# Altium project Voltage and Current Data Loggers and Recorders.PrjPCB
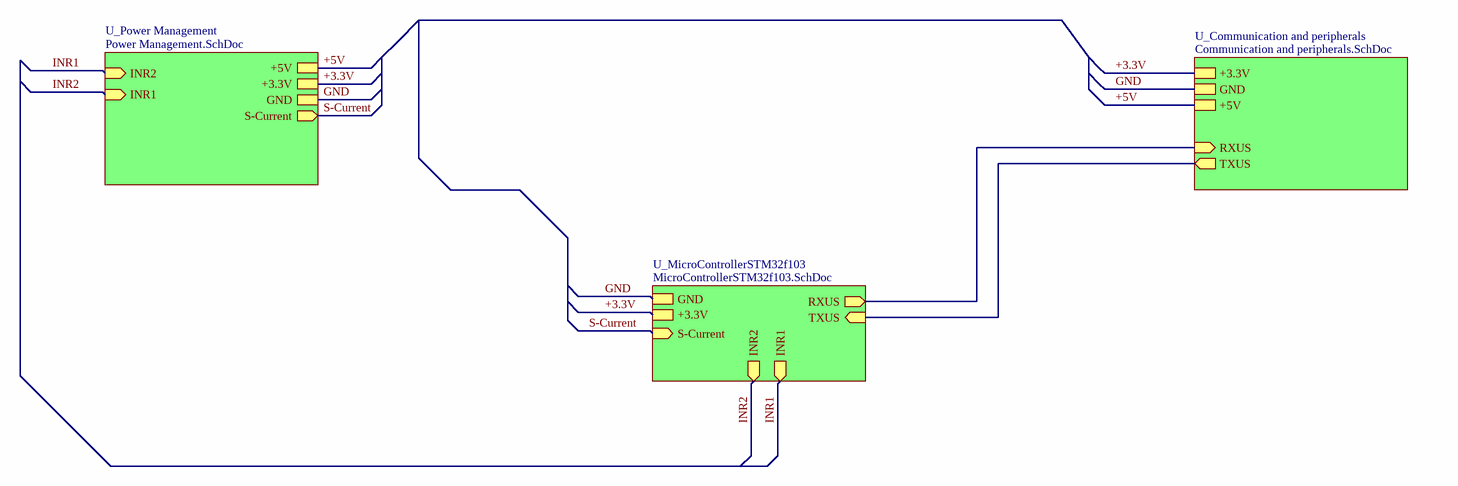
[diagram p0: A dashBoard of Voltage and Current Data Loggers and Recorders.SchDoc]
4 sheets, 71 parts. Net scope: hierarchical (ports join the sheet entries above them; power ports are global).
Board file: Voltage and Current Data Loggers and Recorders.PcbDoc
Sheets:
  A dashBoard of Voltage and Current Data Loggers and Recorders.SchDoc
    U_Communication and peripherals = Communication and peripherals.SchDoc
    U_Power Management = Power Management.SchDoc
    U_MicroControllerSTM32f103 = MicroControllerSTM32f103.SchDoc

## Sheet A dashBoard of Voltage and Current Data Loggers and Recorders.SchDoc
size A4

### Sub-sheets
U_Communication and peripherals = Communication and peripherals.SchDoc: TXUS (out), RXUS (in), GND, +5V, +3.3V
U_MicroControllerSTM32f103 = MicroControllerSTM32f103.SchDoc: GND, +3.3V, RXUS (out), TXUS (in), INR1 (out), INR2 (out), S-Current (in)
U_Power Management = Power Management.SchDoc: +5V, +3.3V, GND, S-Current (out), INR2 (in), INR1 (in)

### Nets
+3.3V: sheet U_Communication and peripherals/+3.3V, sheet U_Power Management/+3.3V, sheet U_MicroControllerSTM32f103/+3.3V
+5V: sheet U_Communication and peripherals/+5V, sheet U_Power Management/+5V
GND: sheet U_Communication and peripherals/GND, sheet U_Power Management/GND, sheet U_MicroControllerSTM32f103/GND
INR1: sheet U_Power Management/INR2, sheet U_MicroControllerSTM32f103/INR1
INR2: sheet U_Power Management/INR1, sheet U_MicroControllerSTM32f103/INR2
RXUS: sheet U_Communication and peripherals/RXUS, sheet U_MicroControllerSTM32f103/RXUS
S-Current: sheet U_Power Management/S-Current, sheet U_MicroControllerSTM32f103/S-Current
TXUS: sheet U_Communication and peripherals/TXUS, sheet U_MicroControllerSTM32f103/TXUS

### Notes on the sheet
- Title
- Size:
- Data:
- CompanyName:
- A4
- Number:
- Time:
- Revision:
- Engineer:
- File:

## Sheet Communication and peripherals.SchDoc
size A4
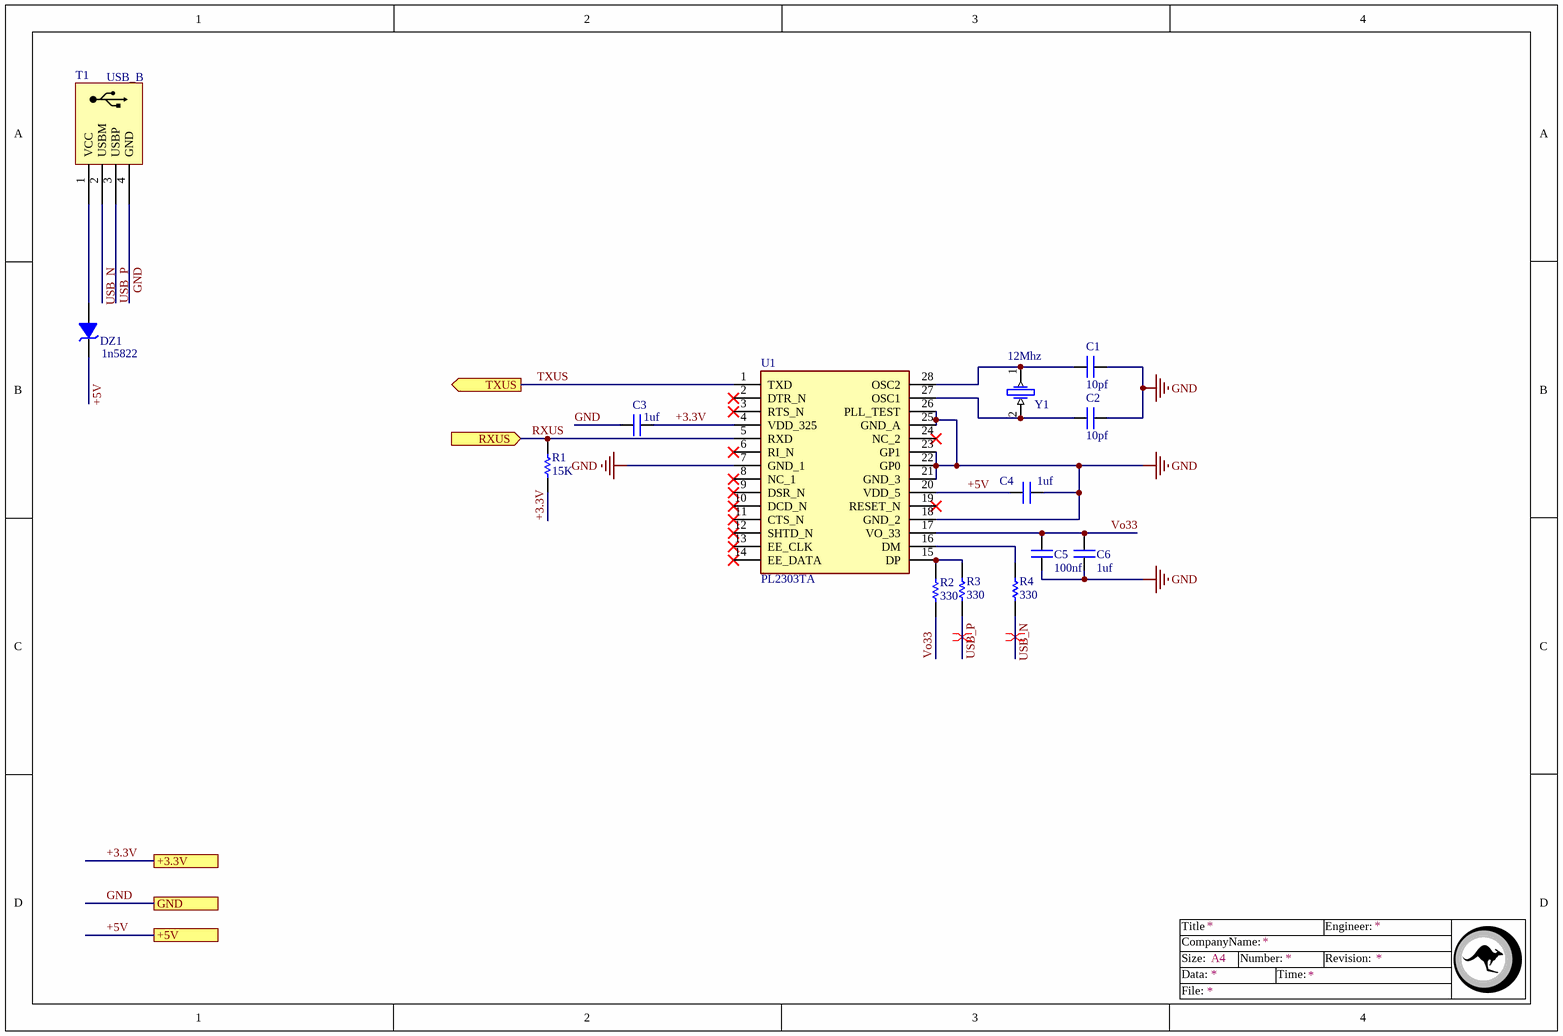
[diagram p1: Communication and peripherals.SchDoc]

### Parts
C1  10pf  [Cap0805]
C2  10pf  [Cap0805]
C3  1uf  [Cap0805]
C4  1uf  [Cap0805]
C5  100nf  [Cap0805]
C6  1uf  [Cap0805]
DZ1  1n5822  [LL4148]
R1  15K  [R0805]
R2  330  [R0805]
R3  330  [R0805]
R4  330  [R0805]
T1  USB_B  [USB_Dip_R]
U1  PL2303TA  [SOP65P780X200-28N]
Y1  12Mhz  [CrystallB]

### Ports
+3.3V, +5V, GND, RXUS (in), TXUS (out)

### Nets
+3.3V: C3.2 R1.1 U1.4(VDD_325) ; port +3.3V
+5V: C4.2 DZ1.K U1.20(VDD_5) ; port +5V
GND: C1.2 C2.2 C3.1 C4.1 C5.1 C6.1 T1.4(GND) U1.7(GND_1) U1.18(GND_2) U1.21(GND_3) U1.22(GP0) U1.23(GP1) U1.25(GND_A) U1.26(PLL_TEST) ; port GND
RXUS: R1.2 U1.5(RXD) ; port RXUS
TXUS: U1.1(TXD) ; port TXUS
USB_N: R4.1 T1.2(USBM)
USB_P: R3.1 T1.3(USBP)
Vo33: C5.2 C6.2 R2.1 U1.17(VO_33)
NetC1_1: C1.1 U1.28(OSC2) Y1.1
NetC2_1: C2.1 U1.27(OSC1) Y1.2
NetDZ1_A: DZ1.A T1.1(VCC)
NetR2_2: R2.2 R3.2 U1.15(DP)
NetR4_2: R4.2 U1.16(DM)

Not connected (* = marked no-connect by the designer): U1 2(DTR_N)* 3(RTS_N)* 6(RI_N)* 8(NC_1)* 9(DSR_N)* 10(DCD_N)* 11(CTS_N)* 12(SHTD_N)* 13(EE_CLK)* 14(EE_DATA)* 19(RESET_N)* 24(NC_2)*

### Layout directives
differential pair: USB_N, USB_P

### Notes on the sheet
- Title
- Size:
- Data:
- CompanyName:
- A4
- Number:
- Time:
- Revision:
- Engineer:
- File:

### Library data of the parts
C1-C6 = Cap: Surface mount Capacitor
DZ1 = Diode Zener
R1-R4 = Resistor
T1 = USB_B: USB B Connector
U1 = PL2303TA: Uart Chip
Y1 = Crystal

## Sheet Power Management.SchDoc
size A4
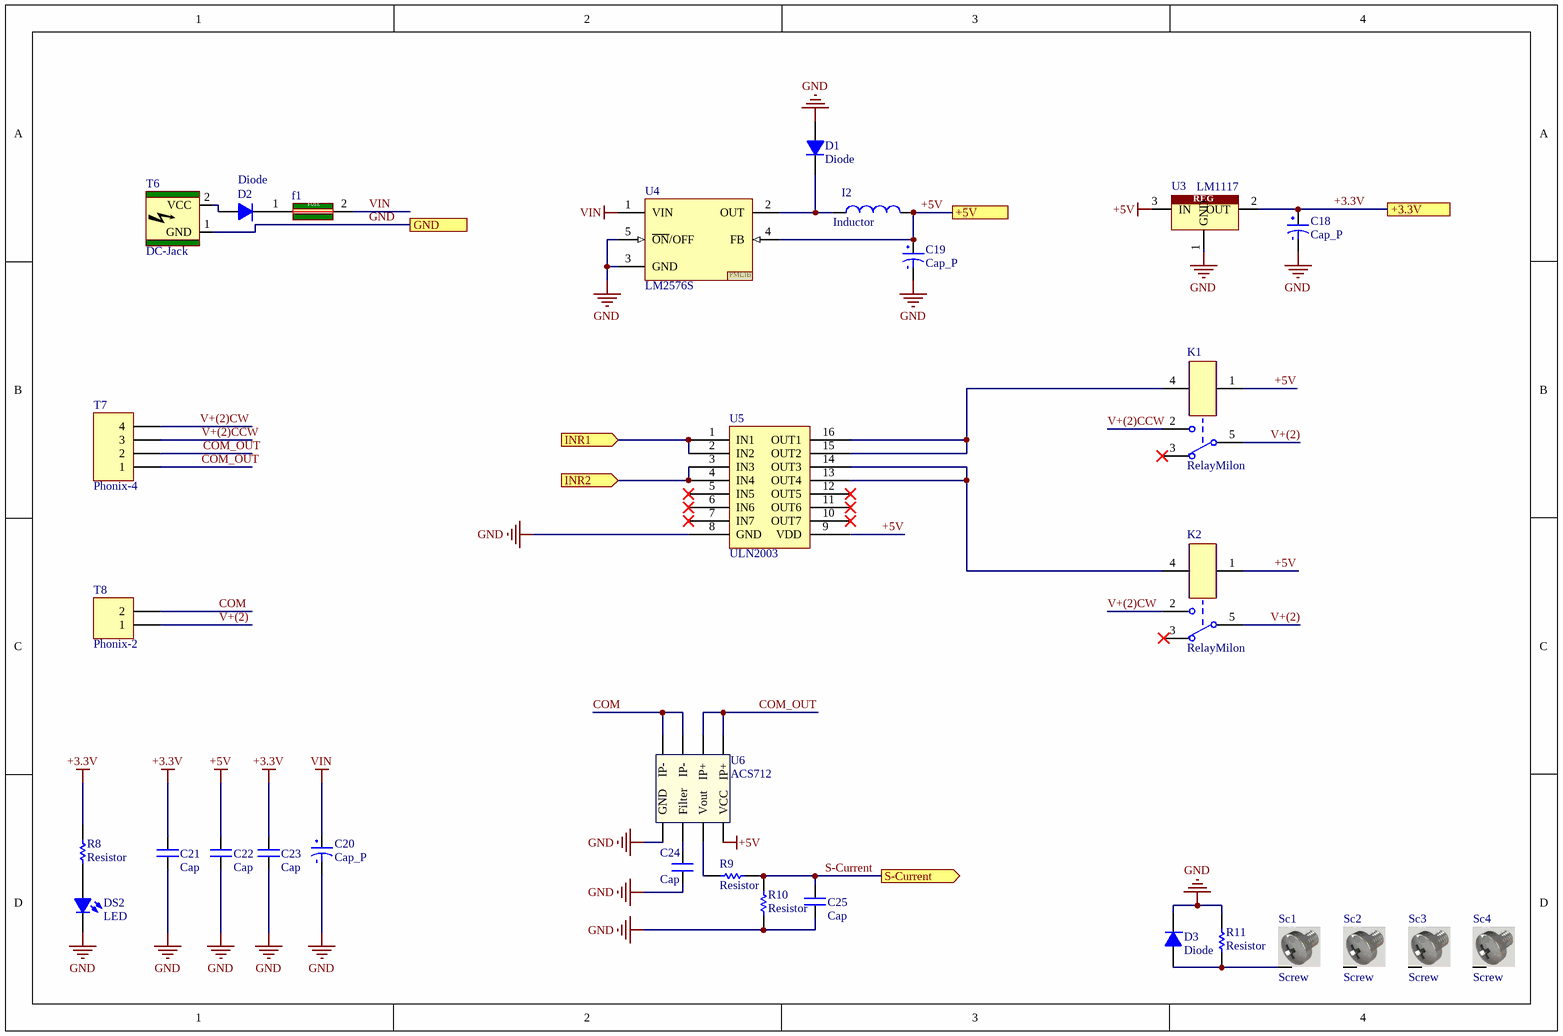
[diagram p2: Power Management.SchDoc]

### Parts
C18  Cap_P  [Cap_4mm]
C19  Cap_P  [Cap_4mm]
C20  Cap_P  [Cap_5mm]
C21  Cap  [Cap0805]
C22  Cap  [Cap0805]
C23  Cap  [Cap0805]
C24  Cap  [Cap0805]
C25  Cap  [Cap0805]
D1  Diode  [Diod-1A-SMD]
D2  Diode  [Diod-1A-SMD]
D3  Diode  [Diod-1A-SMD]
DS2  LED  [Led0805]
f1  Fuse  [1206]  (value not drawn)
I2  Inductor  [Indicator_SMD]
K1  RelayMilon  [Relay_MILONBIG]
K2  RelayMilon  [Relay_MILONBIG]
R8  Resistor  [R0805]
R9  Resistor  [R0805]
R10  Resistor  [R0805]
R11  Resistor  [0603]
Sc1  Screw  [Screw]
Sc2  Screw  [Screw]
Sc3  Screw  [Screw]
Sc4  Screw  [Screw]
T6  DC-Jack  [DC_powerjack]
T7  Phonix-4  [Phonix-4]
T8  Phonix-2  [Phonix-2]
U3  LM1117  [DPACK]
U4  LM2576S  [LM2576S]
U5  ULN2003  [SO16]
U6  ACS712  [SOP8]

### Ports
+3.3V, +5V, GND, INR1 (in), INR2 (in), S-Current (out)

### Nets
+3.3V: C18.2 C21.2 C23.2 R8.1 U3.2(OUT) ; port +3.3V
+5V: C19.2 C22.2 I2.2 K1.1 K2.1 U3.3(IN) U4.4(FB) U5.9(VDD) U6.8(VCC) ; port +5V
GND: C18.1 C19.1 C20.1 C21.1 C22.1 C23.1 C24.1 C25.1 D1.A D3.K DS2.K R10.2 R11.1 T6.1(GND) U3.1(GND) U4.3(GND) U4.5(~{ON}/OFF) U5.8(GND) U6.5(GND) ; port GND
VIN: C20.2 f1.2(OUT) U4.1(VIN)
COM: T8.2 U6.3(IP-) U6.4(IP-)
COM_OUT: T7.1 T7.2 U6.1(IP+) U6.2(IP+)
INR1: U5.3(IN3) U5.4(IN4) ; port INR2
INR2: U5.1(IN1) U5.2(IN2) ; port INR1
S-Current: C25.2 R9.1 R10.1 ; port S-Current
V+(2): K1.5 K2.5 T8.1
V+(2)CCW: K1.2 T7.3
V+(2)CW: K2.2 T7.4
NetC24_2: C24.2 U6.6(Filter)
NetD1_K: D1.K I2.1 U4.2(OUT)
NetD2_A: D2.A T6.2(VCC)
NetD2_K: D2.K f1.1(IN)
NetD3_A: D3.A R11.2 Sc1.S
NetDS2_A: DS2.A R8.2
NetK1_4: K1.4 U5.15(OUT2) U5.16(OUT1)
NetK2_4: K2.4 U5.13(OUT4) U5.14(OUT3)
NetR9_2: R9.2 U6.7(Vout)

Not connected (* = marked no-connect by the designer): K1 3*; K2 3; Sc2 S; Sc3 S; Sc4 S; U5 5(IN5)* 6(IN6)* 7(IN7)* 10(OUT7)* 11(OUT6)* 12(OUT5)*

### Notes on the sheet
- Title
- Size:
- Data:
- CompanyName:
- A4
- Number:
- Time:
- Revision:
- Engineer:
- File:
- (in symbol Fuse) FUSE
- (in symbol LM1117) REG
- (in symbol LM2576S) PMLIB

### Library data of the parts
C18-C20 = Cap_P: Polarity
C21-C25 = Cap: Surface mount Capacitor
I2 = Inductor: Indicator
Sc1-Sc4 = Screw: Screw 3mm
T7 = Phonix-4: Connector
T8 = Phonix-2: Connector
U3 = LM1117: Regulator
U4 = LM2576S: Regulator
U5 = ULN2003: High-voltage, high-current Darlington arrays
U6 = ACS712: Hall effect Current Sensor

## Sheet MicroControllerSTM32f103.SchDoc
size A4
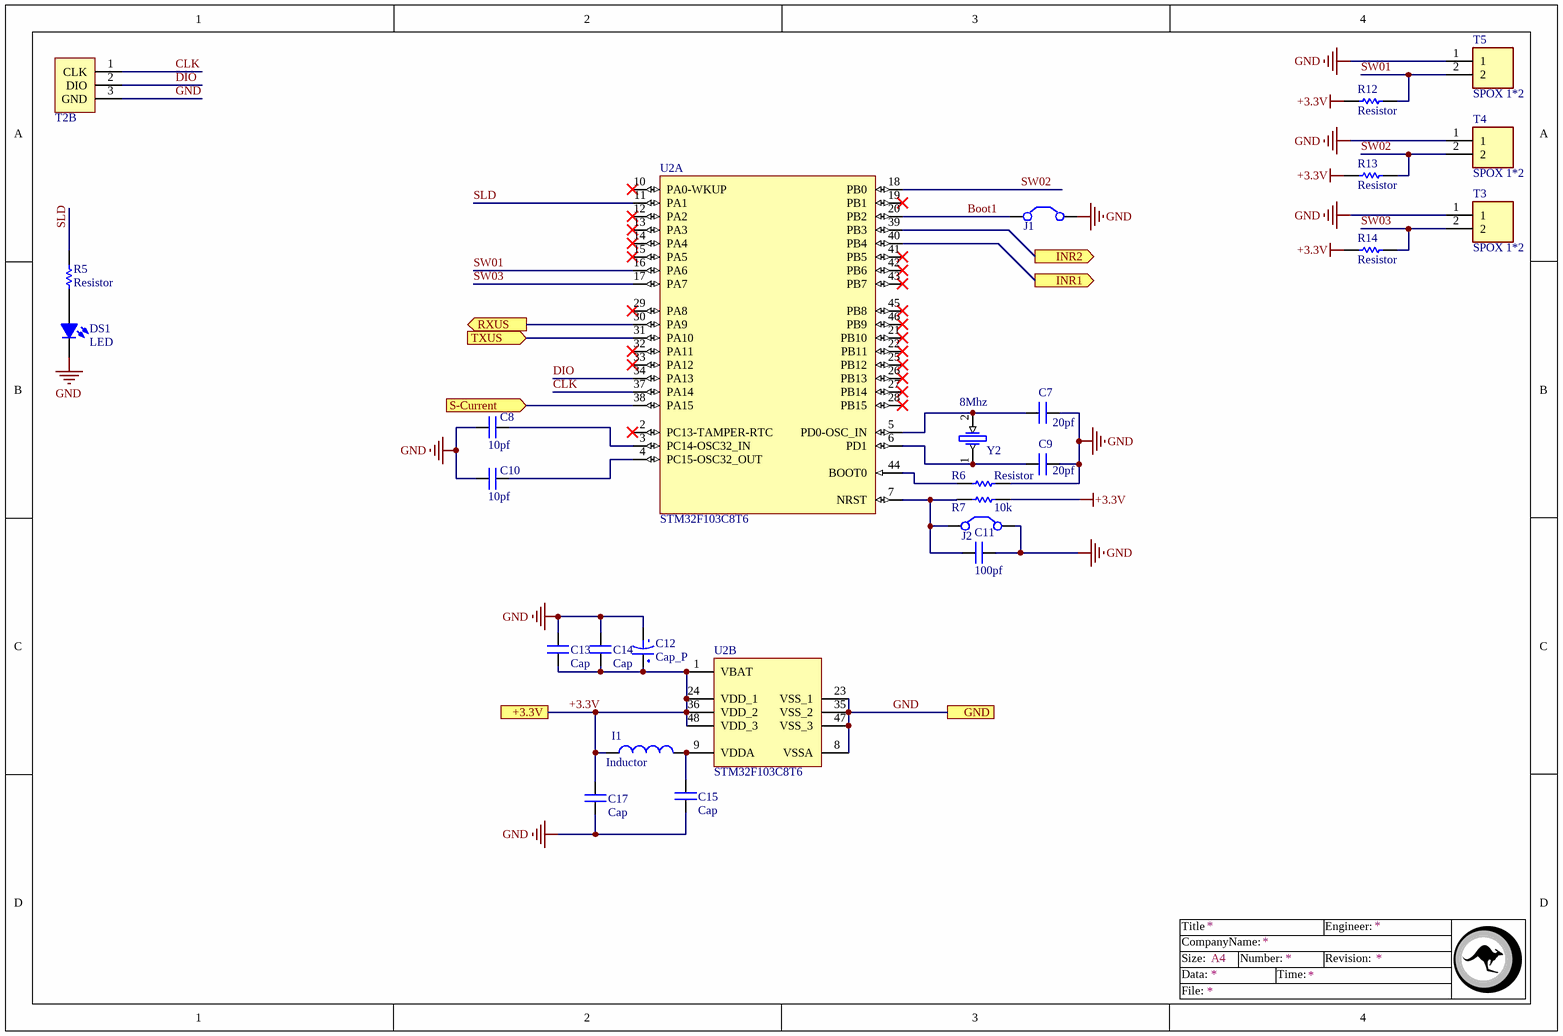
[diagram p3: MicroControllerSTM32f103.SchDoc]

### Parts
C7  20pf  [Cap0805]
C8  10pf  [Cap0805]
C9  20pf  [Cap0805]
C10  10pf  [Cap0805]
C11  100pf  [Cap0805]
C12  Cap_P  [CAPMOL_C]
C13  Cap  [Cap0805]
C14  Cap  [Cap0805]
C15  Cap  [Cap0805]
C17  Cap  [Cap0805]
DS1  LED  [Led0805]
I1  Inductor  [1206]
J1  Jumper  [Jumper SMD - Small]  (value not drawn)
J2  Jumper  [Jumper SMD - Small]  (value not drawn)
R5  Resistor  [R0805]
R6  Resistor  [R0805]
R7  10k  [R0805]
R12  Resistor  [0603]
R13  Resistor  [0603]
R14  Resistor  [0603]
T2  Serial Program  [MHDR1X03-254P - E]  (value not drawn)  (part B of 2)
T3  SPOX 1*2  [SPOX2]
T4  SPOX 1*2  [SPOX2]
T5  SPOX 1*2  [SPOX2]
U2  STM32F103C8T6  [LQFP48_L]  (parts A,B of 2)
Y2  8Mhz  [CrystallB]

### Ports
+3.3V, GND, INR1 (out), INR2 (out), RXUS (out), S-Current (in), TXUS (in)

### Nets
+3.3V: C12.2 C13.1 C14.1 C17.2 I1.1 R7.1 R12.1 R13.1 R14.1 U2.1(VBAT) U2.24(VDD_1) U2.36(VDD_2) U2.48(VDD_3) ; port +3.3V
GND: C7.1 C8.1 C9.1 C10.1 C11.2 C12.1 C13.2 C14.2 C15.1 C17.1 DS1.K J1.2(C2) J2.2(C2) R6.2 T2.3(GND) T3.1 T4.1 T5.1 U2.8(VSSA) U2.23(VSS_1) U2.35(VSS_2) U2.47(VSS_3) ; port GND
Boot1: J1.1(C1) U2.20(PB2)
CLK: T2.1(CLK) U2.37(PA14)
DIO: T2.2(DIO) U2.34(PA13)
INR1: U2.40(PB4) ; port INR1
INR2: U2.39(PB3) ; port INR2
RXUS: U2.30(PA9) ; port RXUS
S-Current: U2.38(PA15) ; port S-Current
SLD: R5.1 U2.11(PA1)
SW01: R12.2 T5.2 U2.16(PA6)
SW02: R13.2 T4.2 U2.18(PB0)
SW03: R14.2 T3.2 U2.17(PA7)
TXUS: U2.31(PA10) ; port TXUS
NetC7_2: C7.2 U2.5(PD0-OSC_IN) Y2.2
NetC8_2: C8.2 U2.3(PC14-OSC32_IN)
NetC9_2: C9.2 U2.6(PD1) Y2.1
NetC10_2: C10.2 U2.4(PC15-OSC32_OUT)
NetC11_1: C11.1 J2.1(C1) R7.2 U2.7(NRST)
NetC15_2: C15.2 I1.2 U2.9(VDDA)
NetDS1_A: DS1.A R5.2
NetR6_1: R6.1 U2.44(BOOT0)

Not connected (* = marked no-connect by the designer): U2 2(PC13-TAMPER-RTC)* 10(PA0-WKUP)* 12(PA2)* 13(PA3)* 14(PA4)* 15(PA5)* 19(PB1)* 21(PB10)* 22(PB11)* 25(PB12)* 26(PB13)* 27(PB14)* 28(PB15)* 29(PA8)* 32(PA11)* 33(PA12)* 41(PB5)* 42(PB6)* 43(PB7)* 45(PB8)* 46(PB9)*

### Notes on the sheet
- Title
- Size:
- Data:
- CompanyName:
- A4
- Number:
- Time:
- Revision:
- Engineer:
- File:

### Library data of the parts
C7-C11 C13-C15 C17 = Cap: Surface mount Capacitor
C12 = Cap_P: Polarity
I1 = Inductor: Indicator
R7 = Resistor
T2 = Serial Program: STM Serial Program pin
U2 = STM32F103C8T6: STM32 ARM-based 32-bit MCU Performance Line with 64 kB Flash, 20 kB Internal RAM, -40 to +85°C Temperature, 48-Pin LQFP, Tray; DatasheetVersion: rev13.0, Apr-2011; PackageVersion: rev13, Apr-2011; PackageReference: LQFP48; PackageDescription: 48-Pin Low-Profile Quad Flat Pack, 7 x 7 mm Body, 0.5 mm Pitch (LQFP48); ComponentLink1Description: Manufacturer URL; ComponentLink1URL: http://www.st.com/; ComponentLink2Description: STM32F103 Datasheet; ComponentLink2URL: http://www.st.com/internet/com/TECHNICAL_RESOURCES/TECHNICAL_LITERATURE/DATASHEET/CD00161566.pdf; ComponentLink3Description: STM32 Family Web Page; ComponentLink3URL: www.st.com/stm32
Y2 = Crystal

## Nets that join several sheets
+3.3V: Communication and peripherals (C3.2 R1.1 U1.4), Power Management (5 pins), MicroControllerSTM32f103 (13 pins)
+5V: Communication and peripherals (C4.2 DZ1.K U1.20), Power Management (9 pins)
GND: Communication and peripherals (14 pins), Power Management (19 pins), MicroControllerSTM32f103 (22 pins)
INR1: Power Management (U5.3 U5.4), MicroControllerSTM32f103 (U2.40)
INR2: Power Management (U5.1 U5.2), MicroControllerSTM32f103 (U2.39)
RXUS: Communication and peripherals (R1.2 U1.5), MicroControllerSTM32f103 (U2.30)
S-Current: Power Management (C25.2 R9.1 R10.1), MicroControllerSTM32f103 (U2.38)
TXUS: Communication and peripherals (U1.1), MicroControllerSTM32f103 (U2.31)